# Altium project MP1584_rule.PrjPcb
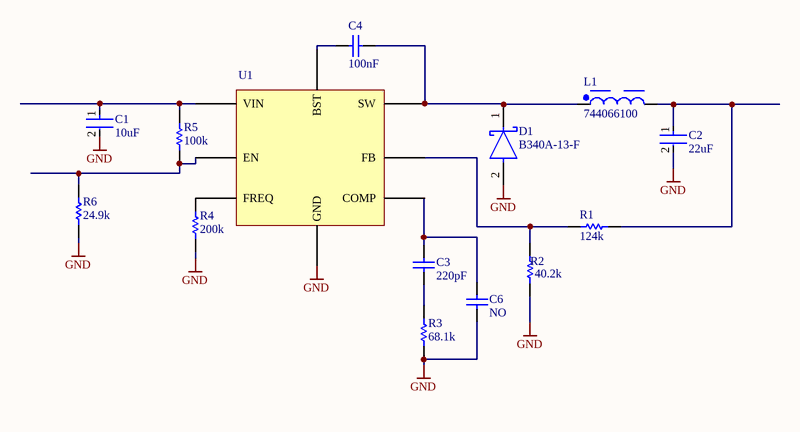
[diagram p0: MP1584_rule.SchDoc]
1 sheet, 14 parts. Net scope: global (net labels, ports and power ports of the same name join across sheets).
Board file: MP1584_rule.PcbDoc

## Sheet MP1584_rule.SchDoc
size A4; SheetNumber: 1; SheetTotal: 1

### Parts
C1  10uF  [FP-C5750-230-0_4-MFG]
C2  22uF  [FP-C5750-230-0_4-MFG]
C3  220pF  [CAPC2013X88X50LL20T25]
C4  100nF  [CAPC2013X145X48NL20T23]
C6  NO  [CAPC2013X88X50LL20T25]
D1  B340A-13-F  [FP-SMA-MFG]
L1  744066100  [WE-TPC_1038]
R1  124k  [RESC2013X70X40LL20T20]
R2  40.2k  [RESC2013X70X40ML20T20]
R3  68.1k  [RESC2013X55X40ML15T20]
R4  200k  [RESC0805(2012)_L]
R5  100k  [RESC2013X50X30ML20T20]
R6  24.9k  [RESC2013X70X40LL20T20]
U1  Component_1  [PCBComponent_1]  (value not drawn)

### Nets
GND: C1.2 C2.2 C6.1 D1.2(A) R2.1 R3.1 R4.1 R6.1 U1.5(GND)
NetC1_1: C1.1 R5.2 U1.7(VIN)
NetC2_1: C2.1 L1.2 R1.2
NetC3_1: C3.1 R3.2
NetC3_2: C3.2 C6.2 U1.3(COMP)
NetC4_1: C4.1 U1.8(BST)
NetC4_2: C4.2 D1.1(C) L1.1 U1.1(SW)
NetR1_1: R1.1 R2.2 U1.4(FB)
NetR4_2: R4.2 U1.6(FREQ)
NetR5_1: R5.1 R6.2 U1.2(EN)

### Library data of the parts
C1 C2 = CMP-08246-002717-1: Multilayer Ceramic Capacitors 10uF ±10% 50V X5R SMD 2220; Width: 0.197inch; Tolerance: 10%; Voltage: 50V; Length: 5.7mm; Thickness: 0.098inch; Termination: SMD/SMT; Packaging: Tape and Reel; REACH SVHC: No SVHC; Depth: 5mm; Package Quantity: 1; Lead Free: Lead Free; Voltage Rating (DC): 50V; Case Code (Imperial): 2220; Height: 2.3mm; Case/Package: 2220; Dielectric: X5R; Case Code (Metric): 5750; Number of Pins: 2; Min Operating Temperature: -55°C; Weight: 0.016932oz; Voltage Rating: 50V; Series: C; Construction: Flat; Resistor Type: Ceramic; Max Operating Temperature: 85°C; Dielectric Material: Ceramic; RoHS Compliant: Yes; Radiation Hardening: No; Mount: Surface Mount
  C1: Capacitance: 10uF
  C2: Capacitance: 22uF
C3 C6 = CMP-2007-00574-1: Part Number: C0805X221J1GACTU; Manufacturer: Kemet
C4 = CMP-2007-03172-1: Manufacturer: Vitramon; Part Number: VJ0805Y104KXXAT
D1 = CMP-1667-00003-3: DIODE SCHOTTKY 40V 3A SMA; Max Forward Surge Current (Ifsm): 80A; Forward Voltage: 500mV; Polarity: Standard; Max Reverse Current: 500uA; Capacitance: 250pF; Element Configuration: Single; Mount: Surface Mount; Output Current: 3A; Radiation Hardening: No; Width: 2.92mm; Current Rating: 3A; Termination: SMD/SMT; Voltage: 40V; Series: -; Max Operating Temperature: 125°C; Current: 3A; Max Repetitive Reverse Voltage (Vrrm): 40V; Min Operating Temperature: -55°C; REACH SVHC: No SVHC; Number of Pins: 2; Average Rectified Current: 3A; Contact Plating: Tin; RoHS Compliant: Yes; Max Reverse Voltage (DC): 40V; Packaging: Tape and Reel; Height: 2.3mm; Length: 4.6mm; Case/Package: SMA; Weight: 0.002258oz; Peak Non-Repetitive Surge Current: 80A; Package Quantity: 5000; Lead Free: Lead Free; Forward Current: 3A; Voltage Rating (DC): 40V
L1 = CMP-0227-00093-3: NexarPartId: 22803276; Tolerance: 30%; Current Rating: 3.6A; Saturation Current: 4A; Shielding: Shielded; Resistance: 28mΩ; DC Resistance (DCR): 25mΩ; Series Resistance: 35mΩ; Inductance: 10µH; Core Material: Ferrite; Test Frequency: 100kHz; Self Resonant Frequency: 20MHz; Ambient Temperature Range Low: -40°C; RoHS: Compliant; Case/Package: Nonstandard; Number of Pins: 2; Width: 10mm; Max Operating Temperature: 125°C; Ambient Temperature Range High: 95°C; Length: 10mm; Min Operating Temperature: -40°C; REACH SVHC: Unknown; Termination: SMD/SMT; Height: 3.8mm; Max DC Current: 3.6A; Mount: Surface Mount; Weight: 1.273007g; Composition: Wirewound; RMS Current (Irms): 3.6A; Inductance Tolerance: 30%; Height - Seated (Max): 4.0894mm; Packaging: Cut Tape (CT); Depth: 10mm
R1 = CMP-2001-00345-1: Manufacturer: Panasonic; Part Number: ERJ-6GEYJ121V
R2 = CMP-2001-00551-1: Manufacturer: Panasonic; Part Number: ERJ6ENF4702V
R3 = CMP-2001-04746-1: Manufacturer: Vishay Dale; Part Number: TNPW080520K0BEEA
R4 = CMP-1013-00129-1: 200K 0.125W 5% 0805 (2012 Metric)  SMD; Value: 200000.00 Ohm; Case-EIA: 0805; Case-Metric: 2012; Tolerance: 5 %; Technology: SMT; Power: 0.125 W
R5 = CMP-2001-04900-1: Manufacturer: Vishay Dale; Part Number: CRCW0805100KJNEA
R6 = CMP-2001-00073-1: Part Number: ERJ-6ENF2492V; Manufacturer: Panasonic
U1 = MP1584